# Altium project Fish_Manager.PrjPcb
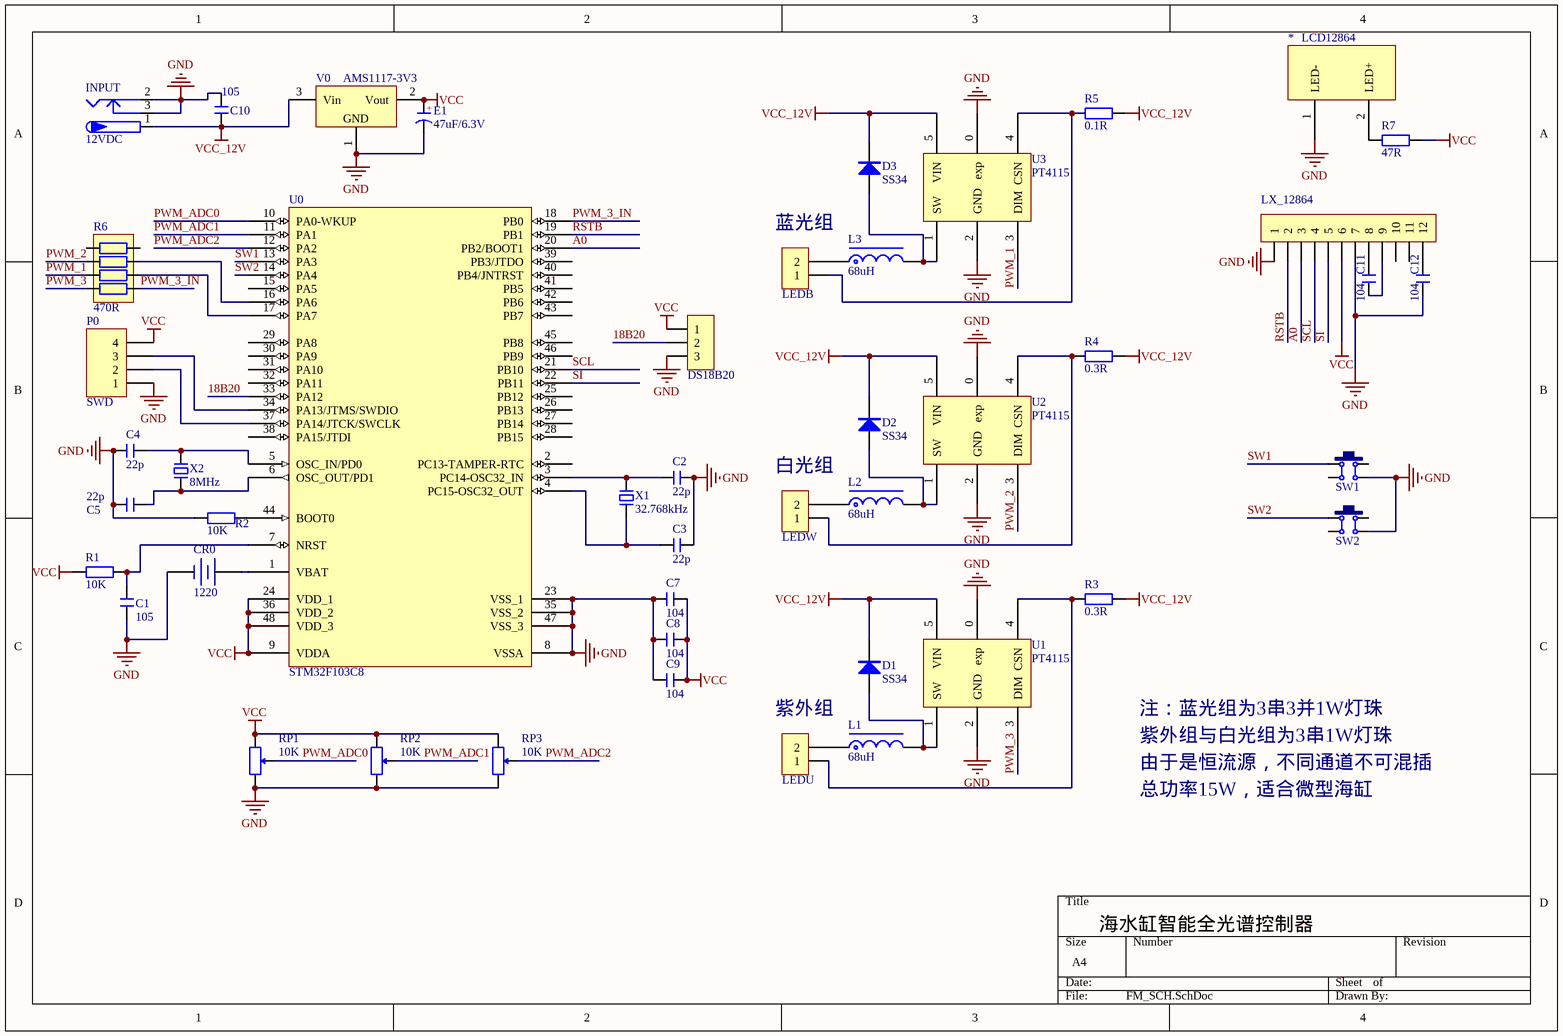
[diagram p0: FM_SCH.SchDoc]
1 sheet, 46 parts. Net scope: global (net labels, ports and power ports of the same name join across sheets).
Board files: FM_PCB.PcbDoc, HOLDING_PCB.PcbDoc

## Sheet FM_SCH.SchDoc
size A4

### Parts
*  LCD12864  [LX_12864]
C1  105  [C 0603_L]
C2  22p  [C 0603_L]
C3  22p  [C 0603_L]
C4  22p  [C 0603_L]
C5  22p  [C 0603_L]
C7  104  [C 0603_L]
C8  104  [C 0603_L]
C9  104  [C 0603_L]
C10  105  [C 0603_L]
C11  104  [C 0603_L]
C12  104  [C 0603_L]
CR0  1220  [CR2032_B]
D1  SS34  [SMA]
D2  SS34  [SMA]
D3  SS34  [SMA]
DS18B20  HDR-1X3  [XH2.54-WS-3P]  (value not drawn)
E1  47uF/6.3V  [CD A(3216)]
INPUT  12VDC  [DC-005]
L1  68uH  [NR5040]
L2  68uH  [NR5040]
L3  68uH  [NR5040]
LEDB  HDR-1X2  [KF2EDGK5.08-WI-2P]  (value not drawn)
LEDU  HDR-1X2  [KF2EDGK5.08-WI-2P]  (value not drawn)
LEDW  HDR-1X2  [KF2EDGK5.08-WI-2P]  (value not drawn)
LX_12864  FPC1.0-12P  [FPC0.5 2H-WS-12P]  (value not drawn)
P0  SWD  [HDR1X4]
R1  10K  [R 0603_L]
R2  10K  [R 0603_L]
R3  0.3R  [R 2010_L]
R4  0.3R  [R 2010_L]
R5  0.1R  [R 2010_L]
R6  470R  [RCA-8P4R-0603]
R7  47R  [R 0603_L]
RP1  10K  [WH148-1-G15]
RP2  10K  [WH148-1-G15]
RP3  10K  [WH148-1-G15]
SW1  6x6x5  [TSW DIP-6*6*8]  (value not drawn)
SW2  6x6x5  [TSW DIP-6*6*8]  (value not drawn)
U0  STM32F103C8  [LQFP48 7X7_M]
U1  PT4115  [SOT89-5]
U2  PT4115  [SOT89-5]
U3  PT4115  [SOT89-5]
V0  AMS1117-3V3  [SOT223_L]
X1  32.768kHz  [OSC 3215-2P]
X2  8MHz  [OSC HC-49SMD]

### Nets
GND: *.1(LED-) C1.1 C2.2 C3.2 C4.1 C5.1 C7.1 C8.1 C9.1 C10.2 C12.2 CR0.2(DC-) DS18B20.3 E1.2(K) INPUT.2 INPUT.3 LX_12864.1 LX_12864.7 P0.1 R2.1 RP1.3 RP2.3 RP3.3 SW1.3 SW2.3 U0.8(VSSA) U0.23(VSS_1) U0.35(VSS_2) U0.47(VSS_3) U1.0(exp) U1.2(GND) U2.0(exp) U2.2(GND) U3.0(exp) U3.2(GND) V0.1(GND)
VCC: C7.2 C8.2 C9.2 DS18B20.1 E1.1(A) LX_12864.6 P0.4 R1.1 R7.2 RP1.1 RP2.1 RP3.1 U0.9(VDDA) U0.24(VDD_1) U0.36(VDD_2) U0.48(VDD_3) V0.2(Vout)
VCC_12V: C10.1 D1.2(K) D2.2(K) D3.2(K) INPUT.1 R3.2 R4.2 R5.2 U1.5(VIN) U2.5(VIN) U3.5(VIN) V0.3(Vin)
18B20: DS18B20.2 U0.33(PA12)
A0: LX_12864.3 U0.20(PB2/BOOT1)
PWM_1: R6.3 U3.3(DIM)
PWM_2: R6.2 U2.3(DIM)
PWM_3: R6.4 U1.3(DIM)
PWM_3_IN: R6.5 U0.18(PB0)
PWM_ADC0: RP1.2 U0.10(PA0-WKUP)
PWM_ADC1: RP2.2 U0.11(PA1)
PWM_ADC2: RP3.2 U0.12(PA2)
RSTB: LX_12864.2 U0.19(PB1)
SCL: LX_12864.4 U0.21(PB10)
SI: LX_12864.5 U0.22(PB11)
SW1: SW1.1 U0.13(PA3)
SW2: SW2.1 U0.14(PA4)
Net*_2: *.2(LED+) R7.1
NetC1_2: C1.2 R1.2 U0.7(NRST)
NetC2_1: C2.1 U0.3(PC14-OSC32_IN) X1.2
NetC3_1: C3.1 U0.4(PC15-OSC32_OUT) X1.1
NetC4_2: C4.2 U0.5(OSC_IN/PD0) X2.2
NetC5_2: C5.2 U0.6(OSC_OUT/PD1) X2.1
NetC11_1: C11.1 LX_12864.9
NetC11_2: C11.2 LX_12864.8
NetC12_1: C12.1 LX_12864.12
NetCR0_1: CR0.1(DC+) U0.1(VBAT)
NetD1_1: D1.1(A) L1.2 U1.1(SW)
NetD2_1: D2.1(A) L2.2 U2.1(SW)
NetD3_1: D3.1(A) L3.2 U3.1(SW)
NetL1_1: L1.1 LEDU.2
NetL2_1: L2.1 LEDW.2
NetL3_1: L3.1 LEDB.2
NetLEDB_1: LEDB.1 R5.1 U3.4(CSN)
NetLEDU_1: LEDU.1 R3.1 U1.4(CSN)
NetLEDW_1: LEDW.1 R4.1 U2.4(CSN)
NetP0_2: P0.2 U0.37(PA14/JTCK/SWCLK)
NetP0_3: P0.3 U0.34(PA13/JTMS/SWDIO)
NetR2_2: R2.2 U0.44(BOOT0)
NetR6_6: R6.6 U0.17(PA7)
NetR6_7: R6.7 U0.16(PA6)

Not connected (* = marked no-connect by the designer): LX_12864 10 11; R6 1 8; SW1 2 4; SW2 2 4; U0 2(PC13-TAMPER-RTC) 15(PA5) 25(PB12) 26(PB13) 27(PB14) 28(PB15) 29(PA8) 30(PA9) 31(PA10) 32(PA11) 38(PA15/JTDI) 39(PB3/JTDO) 40(PB4/JNTRST) 41(PB5) 42(PB6) 43(PB7) 45(PB8) 46(PB9)

### Notes on the sheet
- (near LEDB) 蓝光组
- (near LEDW) 白光组
- (near LEDU) 紫外组
- 注：蓝光组为3串3并1W灯珠
- 紫外组与白光组为3串1W灯珠
- 由于是恒流源，不同通道不可混插
- 总功率15W，适合微型海缸
- 海水缸智能全光谱控制器
- (in symbol C-CD) +

### Library data of the parts
C1-C5 C7-C12 = C: 无极性贴片电容; 版权归属: 源创客; BOM名称: 无极性贴片电容; 学习资源: www.ooocke.com
CR0 = CR-3V: 微型电池; 版权归属: 源创客; BOM名称: 微型电池; 学习资源: www.ooocke.com
D1-D3 = SS14: 肖特基二极管; 版权归属: 源创客; 属性: 40V/1A; BOM名称: 肖特基二极管; 学习资源: www.ooocke.com
DS18B20 = Header 3: 3P接插件; 版权归属: 源创客; BOM名称: 3P接插件; 学习资源: www.ooocke.com
E1 = C-CD: 贴片钽电容; 版权归属: 源创客; BOM名称: 贴片钽电容; 学习资源: www.ooocke.com
INPUT = P-DC: 低压电源接口; BOM名称: DC电源接口; 版权归属: 源创客; 学习资源: www.ooocke.com
L1-L3 = L-NR: NR磁胶电感; 版权归属: 源创客; BOM名称: NR磁胶电感; 学习资源: www.ooocke.com
LEDB LEDU LEDW = Header 2: 2P接插件; 版权归属: 源创客; BOM名称: 2P接插件; 学习资源: www.ooocke.com
LX_12864 = FPC-12P: FPC连接器; 版权归属: 源创客; BOM名称: FPC连接器; 学习资源: www.ooocke.com
P0 = Header 4: Header, 4-Pin; LatestRevisionDate: 17-Jul-2002; LatestRevisionNote: Re-released for DXP Platform.; Publisher: Altium Limited
R1-R5 R7 = R: 贴片电阻; 版权归属: 源创客; BOM名称: 贴片电阻; 学习资源: www.ooocke.com
R6 = R-8P4R: 贴片网络排阻; 版权归属: 源创客; BOM名称: 贴片网络排阻; 学习资源: www.ooocke.com
RP1-RP3 = RP-ID: 插件单联电位器; BOM名称: 插件电位器; 版权归属: 源创客; 学习资源: www.ooocke.com
SW1 SW2 = TSW DIP-6x6: 直插6x6轻触开关; 版权归属: 源创客; BOM名称: 直插6x6轻触开关; 学习资源: www.ooocke.com
U0 = STM32F103C8: Flaah:64/RAM:20/IO:36; BOM名称: 32位STM单片机; 版权归属: 源创客; 学习资源: www.ooocke.com
V0 = AMS1117: 三端稳压芯片; BOM名称: 稳压芯片; 版权归属: 源创客; 学习资源: www.ooocke.com
X1 X2 = XTAL-2P: 2脚无源脚晶振; 版权归属: 源创客; BOM名称: 2脚无源脚晶振; 学习资源: www.ooocke.com